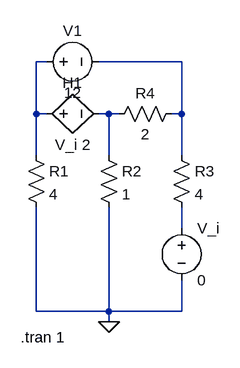
[diagram p0: schematic Ex_03_78.asc]
Ex_03_78.asc, the LTspice schematic file:
Version 4.1
SHEET 1 880 680
WIRE 32 16 16 16
WIRE 240 16 112 16
WIRE 16 96 16 16
WIRE 32 96 16 96
WIRE 128 96 112 96
WIRE 144 96 128 96
WIRE 240 96 240 16
WIRE 240 96 224 96
WIRE 16 160 16 96
WIRE 128 160 128 96
WIRE 240 160 240 96
WIRE 240 272 240 240
WIRE 16 400 16 240
WIRE 128 400 128 240
WIRE 128 400 16 400
WIRE 240 400 240 352
WIRE 240 400 128 400
WIRE 128 416 128 400
FLAG 128 416 0
SYMBOL res 0 144 R0
SYMATTR InstName R1
SYMATTR Value 4
SYMBOL res 112 144 R0
SYMATTR InstName R2
SYMATTR Value 1
SYMBOL res 224 144 R0
SYMATTR InstName R3
SYMATTR Value 4
SYMBOL res 240 80 R90
WINDOW 0 0 56 VBottom 2
WINDOW 3 32 56 VTop 2
SYMATTR InstName R4
SYMATTR Value 2
SYMBOL voltage 16 16 R270
WINDOW 0 32 56 VTop 2
WINDOW 3 -32 56 VBottom 2
WINDOW 123 0 0 Left 0
WINDOW 39 0 0 Left 0
SYMATTR InstName V1
SYMATTR Value 12
SYMBOL voltage 240 256 R0
WINDOW 123 0 0 Left 0
WINDOW 39 0 0 Left 0
SYMATTR InstName V_i
SYMATTR Value 0
SYMBOL h 16 96 R270
WINDOW 0 32 56 VTop 2
WINDOW 3 -32 56 VBottom 2
SYMATTR InstName H1
SYMATTR Value V_i 2
TEXT -8 440 Left 2 !.tran 1

The netlist it stands for:
* Ex_03_78.asc
R1 N001 0 4
R2 N003 0 1
R3 N002 N004 4
R4 N002 N003 2
V1 N001 N002 12
V_i N004 0 0
H1 N001 N003 V_i 2
.tran 1
.backanno
.end